# EAGLE schematic board_rev3 (EAGLE 4.16)
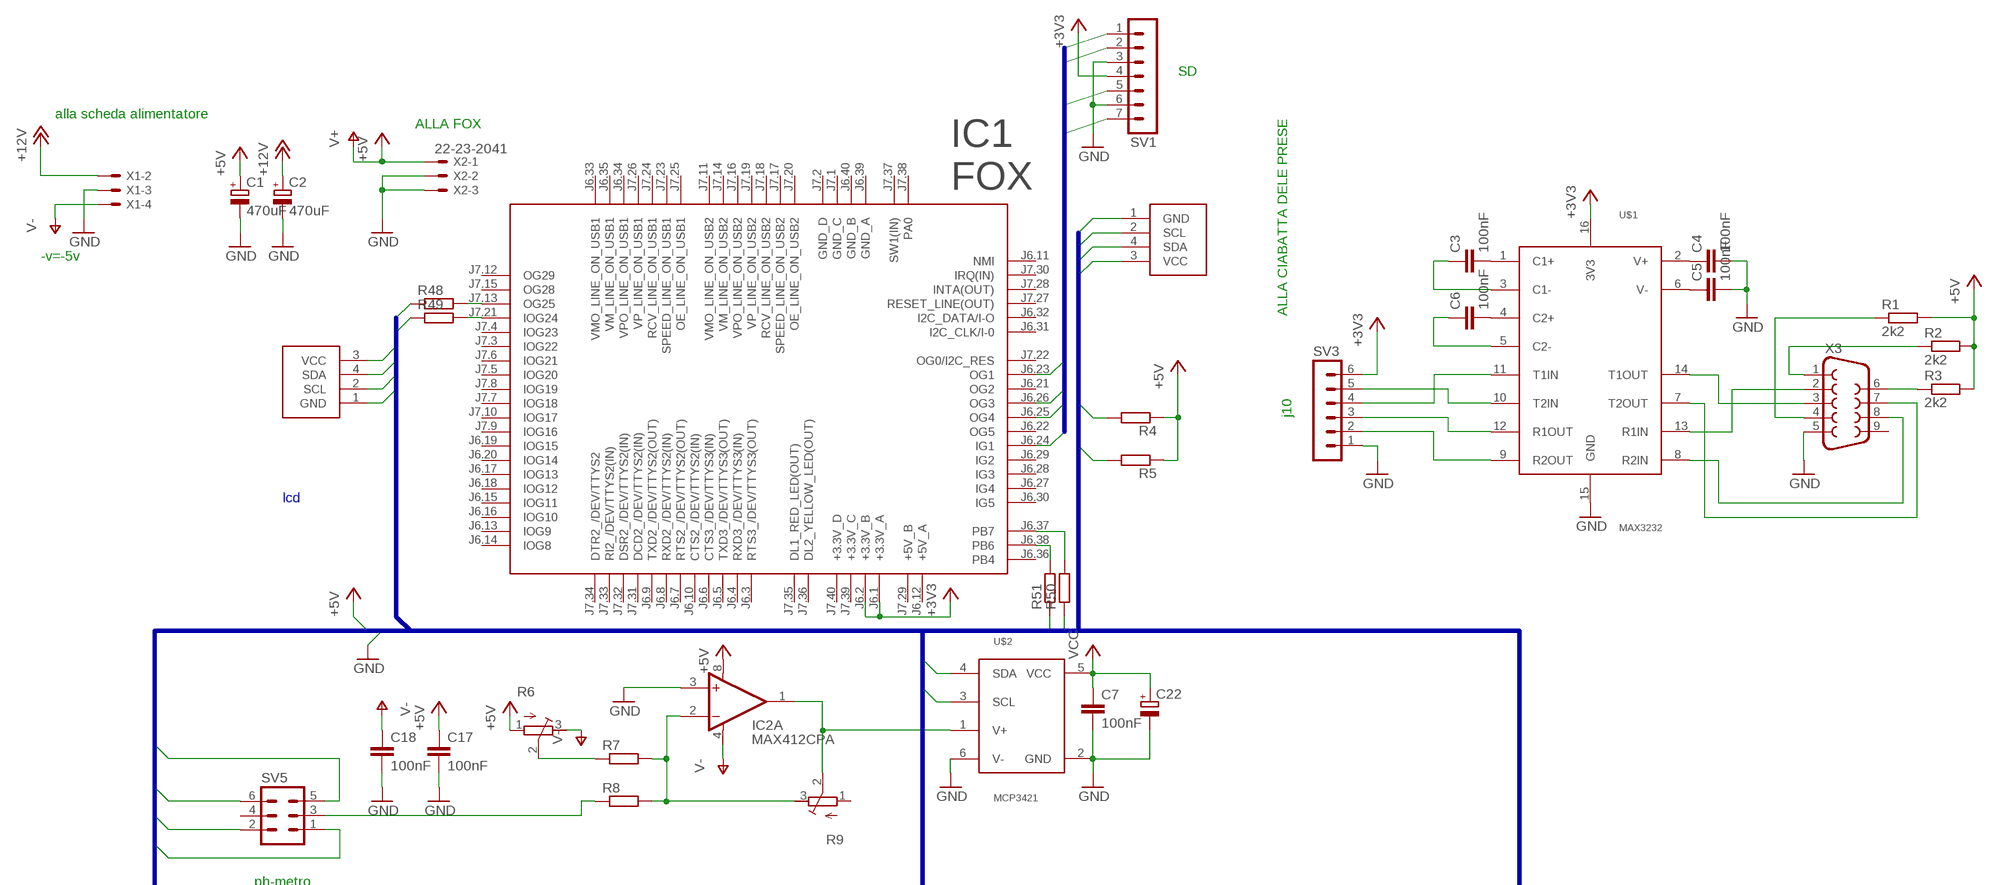
[diagram p0: schematic, sheet 1, part 1 of 2]
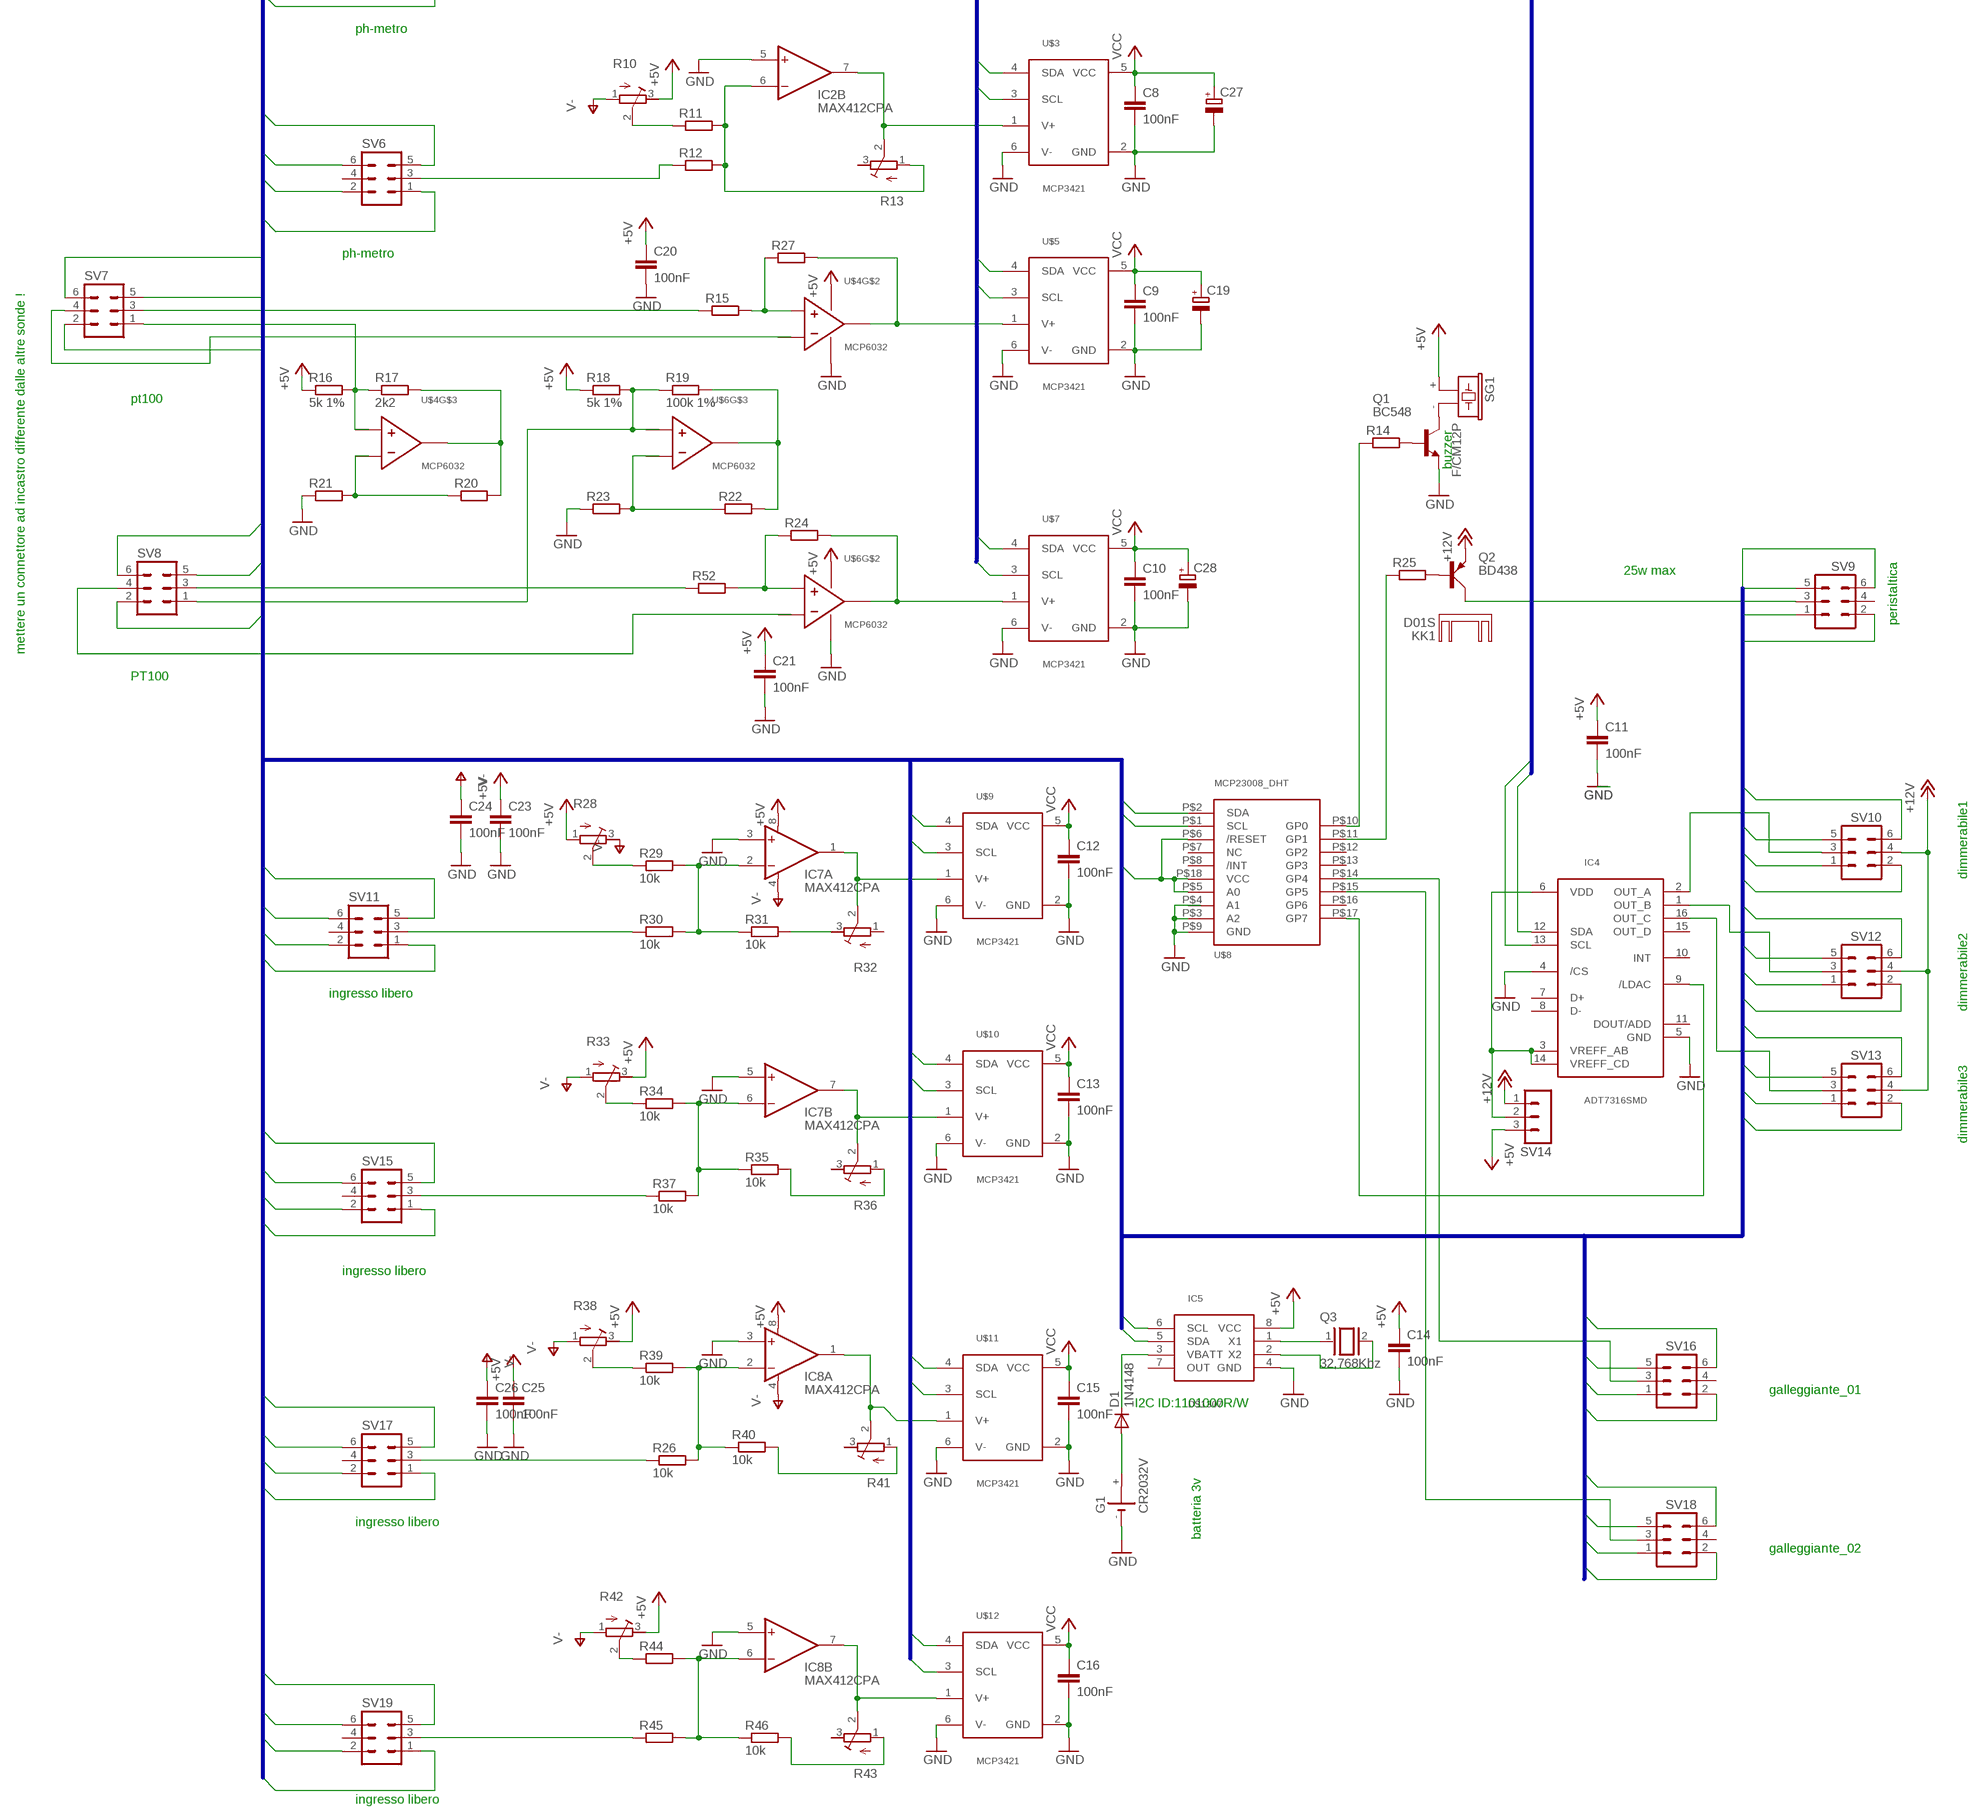
[diagram p1: schematic, sheet 1, part 2 of 2]

## Parts
C1  470uF  CPOL-EUE5-10.5  [E5-10,5]
C2  470uF  CPOL-EUE5-10.5  [E5-10,5]
C3  100nF  C-EUC0402  [C0402]
C4  100nF  C-EUC0402  [C0402]
C5  100nF  C-EUC0402  [C0402]
C6  100nF  C-EUC0402  [C0402]
C7  100nF  C-EUC0402  [C0402]
C8  100nF  C-EUC0402  [C0402]
C9  100nF  C-EUC0402  [C0402]
C10  100nF  C-EUC0402  [C0402]
C11  100nF  C-EUC0402  [C0402]
C12  100nF  C-EUC0402  [C0402]
C13  100nF  C-EUC0402  [C0402]
C14  100nF  C-EUC0402  [C0402]
C15  100nF  C-EUC0402  [C0402]
C16  100nF  C-EUC0402  [C0402]
C17  100nF  C-EUC0402  [C0402]
C18  100nF  C-EUC0402  [C0402]
C19  CPOL-EUB/3528-21W  [B/3528-21W]
C20  100nF  C-EUC0402  [C0402]
C21  100nF  C-EUC0402  [C0402]
C22  CPOL-EUB/3528-21W  [B/3528-21W]
C23  100nF  C-EUC0402  [C0402]
C24  100nF  C-EUC0402  [C0402]
C25  100nF  C-EUC0402  [C0402]
C26  100nF  C-EUC0402  [C0402]
C27  CPOL-EUB/3528-21W  [B/3528-21W]
C28  CPOL-EUB/3528-21W  [B/3528-21W]
D1  1N4148  [DO35-10]
G1  CR2032V  [CR2032V]
IC1  FOX  [FOX]
IC2  MAX412CPA  [DIL08]
IC4  ADT7316SMD  [ADT7318SMD]
IC5  DS1307  [DS1307]
IC7  MAX412CPA  [DIL08]
IC8  MAX412CPA  [DIL08]
KK1  D01S  [D01S]
Q1  BC548  [TO92-EBC]
Q2  BD438  [TO126AV]
Q3  32,768Khz  XTAL  [Q]
R1  2k2  R-EU_0207/10  [0207/10]
R2  2k2  R-EU_0207/10  [0207/10]
R3  2k2  R-EU_0207/10  [0207/10]
R4  R-EU_R0805  [R0805]
R5  R-EU_R0805  [R0805]
R6  R-TRIMM4G/J  [RTRIM4G/J]
R7  R-EU_0309/V  [0309V]
R8  R-EU_0207/10  [0207/10]
R9  R-TRIMM4G/J  [RTRIM4G/J]
R10  R-TRIMM4G/J  [RTRIM4G/J]
R11  R-EU_0309/V  [0309V]
R12  R-EU_0207/10  [0207/10]
R13  R-TRIMM4G/J  [RTRIM4G/J]
R14  R-EU_0309/V  [0309V]
R15  R-EU_0207/5V  [0207/5V]
R16  5k 1%  R-EU_0207/10  [0207/10]
R17  2k2  R-EU_0207/10  [0207/10]
R18  5k 1%  R-EU_0207/10  [0207/10]
R19  100k 1%  R-EU_0207/10  [0207/10]
R20  R-EU_0207/5V  [0207/5V]
R21  R-EU_0207/5V  [0207/5V]
R22  R-EU_0207/5V  [0207/5V]
R23  R-EU_0207/5V  [0207/5V]
R24  R-EU_0207/5V  [0207/5V]
R25  R-EU_0207/5V  [0207/5V]
R26  10k  R-EU_0411/3V  [0411V]
R27  R-EU_0309/V  [0309V]
R28  R-TRIMM4G/J  [RTRIM4G/J]
R29  10k  R-EU_0207/10  [0207/10]
R30  10k  R-EU_0207/10  [0207/10]
R31  10k  R-EU_0411/3V  [0411V]
R32  R-TRIMM4G/J  [RTRIM4G/J]
R33  R-TRIMM4G/J  [RTRIM4G/J]
R34  10k  R-EU_0207/10  [0207/10]
R35  10k  R-EU_0411/3V  [0411V]
R36  R-TRIMM4G/J  [RTRIM4G/J]
R37  10k  R-EU_0207/10  [0207/10]
R38  R-TRIMM4G/J  [RTRIM4G/J]
R39  10k  R-EU_0411/3V  [0411V]
R40  10k  R-EU_0411/3V  [0411V]
R41  R-TRIMM4G/J  [RTRIM4G/J]
R42  R-TRIMM4G/J  [RTRIM4G/J]
R43  R-TRIMM4G/J  [RTRIM4G/J]
R44  R-EU_0309/V  [0309V]
R45  R-EU_0309/V  [0309V]
R46  10k  R-EU_0411/3V  [0411V]
R48  R-EU_R0805  [R0805]
R49  R-EU_R0805  [R0805]
R50  R-EU_R0805  [R0805]
R51  R-EU_R0805  [R0805]
R52  R-EU_0309/V  [0309V]
SG1  F/CM12P  [F/CM12P]
SV1  MA07-1  [MA07-1]
SV3  MA06-1  [MA06-1]
SV5  MA03-2  [MA03-2]
SV6  MA03-2  [MA03-2]
SV7  MA03-2  [MA03-2]
SV8  MA03-2  [MA03-2]
SV9  MA03-2  [MA03-2]
SV10  MA03-2  [MA03-2]
SV11  MA03-2  [MA03-2]
SV12  MA03-2  [MA03-2]
SV13  MA03-2  [MA03-2]
SV14  MA03-1  [MA03-1]
SV15  MA03-2  [MA03-2]
SV16  MA03-2  [MA03-2]
SV17  MA03-2  [MA03-2]
SV18  MA03-2  [MA03-2]
SV19  MA03-2  [MA03-2]
U$1  MAX3232  [MAX3232]
U$2  MCP3421  [MCP3421]
U$3  MCP3421  [MCP3421]
U$4  MAX6032  [MAX6032]
U$5  MCP3421  [MCP3421]
U$6  MAX6032  [MAX6032]
U$7  MCP3421  [MCP3421]
U$8  MCP23008_DHT  [MCP23008_DHT]
U$9  MCP3421  [MCP3421]
U$10  MCP3421  [MCP3421]
U$11  MCP3421  [MCP3421]
U$12  MCP3421  [MCP3421]
U$13  J-I2C  [J-I2C]
U$14  J-I2C  [J-I2C]
X1  22-23-2041  [22-23-2041]
X2  22-23-2041  [22-23-2041]
X3  F09H  [F09H]

## Nets
5V: SV5.5 SV6.5 SV7.4 SV7.5 SV8.5 SV9.5 SV10.5 SV11.5 SV12.5 SV13.5 SV15.5 SV16.5 SV17.5 SV18.5 SV19.5 U$8.P$5(A0) U$8.P$6(/RESET) U$8.P$18(VCC) U$13.3(VCC) U$14.3(VCC) ; supply symbol labelled +5V
+3V3: IC1.J6.1(+3.3V_A) IC1.J6.2(+3.3V_B) SV1.4 SV3.6 U$1.16(3V3)
+5V: C1.+ C11.1 C14.1 C17.1 C20.1 C21.1 C23.1 C25.1 IC5.8(VCC) IC7.8(A:V+) IC8.8(A:V+) R1.2 R2.2 R3.2 R4.1 R5.1 R6.1(E) R10.3(A) R16.1 R18.1 R28.1(E) R33.3(A) R38.3(A) R42.3(A) SG1.+ SV14.3 U$4.P$8(VCC) U$6.P$8(VCC) X2.1 ; supply symbol labelled V+
+12V: C2.+ Q2.E SV10.4 SV12.4 SV13.4 SV14.1 X1.2
CH0: IC8.7(B:OUT) R43.2(S) U$12.1(V+)
CH1: IC8.1(A:OUT) R41.2(S) U$11.1(V+)
CH2: IC7.7(B:OUT) R36.2(S) U$10.1(V+)
CH3: IC7.1(A:OUT) R32.2(S) U$9.1(V+)
GND: C1.- C2.- C4.2 C5.2 C7.2 C8.2 C9.2 C10.2 C11.2 C12.2 C13.2 C14.2 C15.2 C16.2 C17.2 C18.2 C19.- C20.2 C21.2 C22.- C23.2 C24.2 C25.2 C26.2 C27.- C28.- G1.- IC2.3(A:+IN) IC2.5(B:+IN) IC4.4(/CS) IC4.5(GND) IC5.4(GND) IC7.3(A:+IN) IC7.5(B:+IN) IC8.3(A:+IN) IC8.5(B:+IN) Q1.E R21.1 R23.1 SV1.3 SV1.6 SV3.1 SV5.1 SV6.1 SV9.1 SV10.1 SV11.1 SV12.1 SV13.1 SV15.1 SV16.1 SV17.1 SV18.1 SV19.1 U$1.15(GND) U$2.2(GND) U$2.6(V-) U$3.2(GND) U$3.6(V-) U$4.P$4(GND) U$5.2(GND) U$5.6(V-) U$6.P$4(GND) U$7.2(GND) U$7.6(V-) U$8.P$3(A2) U$8.P$9(GND) U$9.2(GND) U$9.6(V-) U$10.2(GND) U$10.6(V-) U$11.2(GND) U$11.6(V-) U$12.2(GND) U$12.6(V-) U$13.1(GND) U$14.1(GND) X1.3 X2.2 X2.3 X3.5
N$1: R14.1 U$8.P$10(GP0)
N$2: R17.2 R20.2 U$4.P$7(O)
N$3: R19.2 R22.2 U$6.P$7(O)
N$4: D1.C IC5.3(VBATT)
N$5: R24.1 R52.2
N$6: R15.2 R27.1
N$7: SV8.4
N$8: R20.1 R21.2
N$9: IC2.1(A:OUT) R9.2(S) U$2.1(V+)
N$10: IC2.7(B:OUT) R13.2(S) U$3.1(V+)
N$11: SV18.3 U$8.P$15(GP5)
N$12: D1.A G1.+
N$13: R27.2 U$4.P$1(O) U$5.1(V+)
N$14: Q2.B R25.2
N$15: IC1.J7.13(OG25) R48.2
N$16: R25.1 U$8.P$11(GP1)
N$17: IC4.16(OUT_C) SV13.3
N$18: SV16.3 U$8.P$14(GP4)
N$19: Q2.C SV9.3
N$20: Q1.C SG1.-
N$21: IC4.3(VREFF_AB) IC4.6(VDD) IC4.14(VREFF_CD) SV14.2
N$22: R24.2 U$6.P$1(O) U$7.1(V+)
N$23: IC4.2(OUT_A) SV10.3
N$25: IC4.9(/LDAC) U$8.P$17(GP7)
N$26: Q1.B R14.2
N$27: C3.2 U$1.1(C1+)
N$28: R18.2 R19.1 SV8.1
N$29: R16.2 R17.1 SV7.1
N$30: R35.2 R36.1(E)
N$31: R10.2(S) R11.1
N$33: R40.2 R41.1(E)
N$34: R43.1(E) R46.2
N$35: R31.2 R32.3(A)
N$36: U$1.14(T1OUT) X3.3
N$37: R15.1 SV7.3
N$38: R52.1 SV8.3
N$39: C6.2 U$1.4(C2+)
N$40: U$1.13(R1IN) X3.2
N$41: C5.1 U$1.6(V-)
N$42: C3.1 U$1.3(C1-)
N$43: C4.1 U$1.2(V+)
N$44: C6.1 U$1.5(C2-)
N$45: U$1.8(R2IN) X3.8
N$46: U$1.7(T2OUT) X3.7
N$47: R2.1 X3.1
N$48: R1.1 X3.4
N$49: R3.1 X3.6
N$50: IC4.1(OUT_B) SV12.3
N$53: IC1.J7.21(IOG24) R49.2
N$54: IC1.J6.38(PB6) R51.2
N$55: SV3.4 U$1.11(T1IN)
N$56: SV3.3 U$1.12(R1OUT)
N$57: SV3.5 U$1.10(T2IN)
N$58: IC2.2(A:-IN) R7.2 R8.2 R9.3(A)
N$59: SV3.2 U$1.9(R2OUT)
N$60: R8.1 SV5.3
N$61: IC1.J6.37(PB7) R50.2
N$62: R6.2(S) R7.1
N$63: IC2.6(B:-IN) R11.2 R12.2 R13.1(E)
N$66: R22.1 R23.2
N$69: R12.1 SV6.3
N$83: IC5.1(X1) Q3.1
N$84: IC5.2(X2) Q3.2
N$113: IC7.2(A:-IN) R29.2 R30.2 R31.1
N$114: IC7.6(B:-IN) R34.2 R35.1 R37.2
N$115: IC8.2(A:-IN) R26.2 R39.2 R40.1
N$116: IC8.6(B:-IN) R44.2 R45.2 R46.1
N$117: R45.1 SV19.3
N$119: R26.1 SV17.3
N$121: R42.2(S) R44.1
N$122: R38.2(S) R39.1
N$123: R33.2(S) R34.1
N$124: R37.1 SV15.3
N$125: R30.1 SV11.3
N$126: R28.2(S) R29.1
SCL: IC4.13(SCL) IC5.6(SCL) R5.2 R48.1 R50.1 SV5.2 SV6.2 SV7.2 SV8.2 SV9.2 SV10.2 SV11.2 SV12.2 SV13.2 SV15.2 SV16.2 SV17.2 SV18.2 SV19.2 U$2.3(SCL) U$3.3(SCL) U$5.3(SCL) U$7.3(SCL) U$8.P$1(SCL) U$9.3(SCL) U$10.3(SCL) U$11.3(SCL) U$12.3(SCL) U$13.2(SCL) U$14.2(SCL)
SD1: IC1.J6.26(OG3) SV1.1
SD2: IC1.J6.25(OG4) SV1.2
SD5: IC1.J6.23(OG1) SV1.5
SD7: IC1.J6.24(IG1) SV1.7
SDA: IC4.12(SDA) IC5.5(SDA) R4.2 R49.1 R51.1 SV5.6 SV6.6 SV7.6 SV8.6 SV9.6 SV10.6 SV11.6 SV12.6 SV13.6 SV15.6 SV16.6 SV17.6 SV18.6 SV19.6 U$2.4(SDA) U$3.4(SDA) U$5.4(SDA) U$7.4(SDA) U$8.P$2(SDA) U$9.4(SDA) U$10.4(SDA) U$11.4(SDA) U$12.4(SDA) U$13.4(SDA) U$14.4(SDA)
V-: C18.1 C24.1 C26.1 IC7.4(A:V-) IC8.4(A:V-) R6.3(A) R10.1(E) R28.3(A) R33.1(E) R38.1(E) R42.1(E) X1.4
VCC: C7.1 C8.1 C9.1 C10.1 C12.1 C13.1 C15.1 C16.1 C19.+ C22.+ C27.+ C28.+ U$2.5(VCC) U$3.5(VCC) U$5.5(VCC) U$7.5(VCC) U$9.5(VCC) U$10.5(VCC) U$11.5(VCC) U$12.5(VCC)
Unconnected: G1.+@1(+) IC1.J6.3(RTS3_/DEV/TTYS3(OUT)) IC1.J6.4(RXD3_/DEV/TTYS3(IN)) IC1.J6.5(TXD3_/DEV/TTYS3(OUT)) IC1.J6.6(CTS3_/DEV/TTYS3(IN)) IC1.J6.7(RTS2_/DEV/TTYS2(OUT)) IC1.J6.8(RXD2_/DEV/TTYS2(IN)) IC1.J6.9(TXD2_/DEV/TTYS2(OUT)) IC1.J6.10(CTS2_/DEV/TTYS2(IN)) IC1.J6.11(NMI) IC1.J6.12(+5V_A) IC1.J6.13(IOG9) IC1.J6.14(IOG8) IC1.J6.15(IOG11) IC1.J6.16(IOG10) IC1.J6.17(IOG13) IC1.J6.18(IOG12) IC1.J6.19(IOG15) IC1.J6.20(IOG14) IC1.J6.21(OG2) IC1.J6.22(OG5) IC1.J6.27(IG4) IC1.J6.28(IG3) IC1.J6.29(IG2) IC1.J6.30(IG5) IC1.J6.31(I2C_CLK/I-0) IC1.J6.32(I2C_DATA/I-O) IC1.J6.33(VMO_LINE_ON_USB1) IC1.J6.34(VPO_LINE_ON_USB1) IC1.J6.35(VM_LINE_ON_USB1) IC1.J6.36(PB4) IC1.J6.39(GND_A) IC1.J6.40(GND_B) IC1.J7.1(GND_C) IC1.J7.2(GND_D) IC1.J7.3(IOG22) IC1.J7.4(IOG23) IC1.J7.5(IOG20) IC1.J7.6(IOG21) IC1.J7.7(IOG18) IC1.J7.8(IOG19) IC1.J7.9(IOG16) IC1.J7.10(IOG17) IC1.J7.11(VMO_LINE_ON_USB2) IC1.J7.12(OG29) IC1.J7.14(VM_LINE_ON_USB2) IC1.J7.15(OG28) IC1.J7.16(VPO_LINE_ON_USB2) IC1.J7.17(SPEED_LINE_ON_USB2) IC1.J7.18(RCV_LINE_ON_USB2) IC1.J7.19(VP_LINE_ON_USB2) IC1.J7.20(OE_LINE_ON_USB2) IC1.J7.22(OG0/I2C_RES) IC1.J7.23(SPEED_LINE_ON_USB1) IC1.J7.24(RCV_LINE_ON_USB1) IC1.J7.25(OE_LINE_ON_USB1) IC1.J7.26(VP_LINE_ON_USB1) IC1.J7.27(RESET_LINE(OUT)) IC1.J7.28(INTA(OUT)) IC1.J7.29(+5V_B) IC1.J7.30(IRQ(IN)) IC1.J7.31(DCD2_/DEV/TTYS2(IN)) IC1.J7.32(DSR2_/DEV/TTYS2(IN)) IC1.J7.33(RI2_/DEV/TTYS2(IN)) IC1.J7.34(DTR2_/DEV/TTYS2) IC1.J7.35(DL1_RED_LED(OUT)) IC1.J7.36(DL2_YELLOW_LED(OUT)) IC1.J7.37(SW1(IN)) IC1.J7.38(PA0) IC1.J7.39(+3.3V_C) IC1.J7.40(+3.3V_D) IC4.7(D+) IC4.8(D-) IC4.10(INT) IC4.11(DOUT/ADD) IC4.15(OUT_D) IC5.7(OUT) R9.1(E) R13.3(A) R32.1(E) R36.3(A) R41.3(A) R43.3(A) SV5.4 SV6.4 SV9.4 SV11.4 SV15.4 SV16.4 SV17.4 SV18.4 SV19.4 U$4.P$2(-) U$4.P$3(+) U$4.P$5(+) U$4.P$6(-) U$6.P$2(-) U$6.P$3(+) U$6.P$5(+) U$6.P$6(-) U$8.P$4(A1) U$8.P$7(NC) U$8.P$8(/INT) U$8.P$12(GP2) U$8.P$13(GP3) U$8.P$16(GP6) X1.1 X2.4 X3.9

## Buses
BUS:SDA,SCL,GND,5V
SD[1..7]

## Notes on the sheet
- SD
- alla scheda alimentatore | ALLA FOX | ALLA CIABATTA DELE PRESE
- -v=-5v
- j10
- lcd
- ph-metro
- ph-metro
- pt100
- buzzer
- peristaltica
- 25w max
- mettere un connettore ad incastro differente dalle altre sonde !
- PT100
- dimmerabile1
- ingresso libero
- dimmerabile2
- dimmerabile3
- ingresso libero
- galleggiante_01
- I2C ID:1101000R/W
- ingresso libero
- batteria 3v
- galleggiante_02
- ingresso libero

## Power pins joined to a net without a drawn wire
V+: IC2.8(A:V+)
V-: IC2.4(A:V-)

## Library data of the parts
C1 C2 C19 C22 C27 C28 = rcl:CPOL-EU: POLARIZED CAPACITOR, European symbol
C3-C18 C20 C21 C23-C26 = rcl:C-EU: CAPACITOR, European symbol
D1 = diode:1N4148: DIODE high speed (Philips)
G1 = battery:CR2032V: LI BATTERY Varta
IC1 = aggiunte:FOX: FOXBOARD Un sistema linux embedded completo www.acmesystem.it
IC2 IC7 IC8 = maxim:MAX412CPA: OP AMP
IC4 = aggiunte:ADT7316SMD: ADT7318 smd I2C DAC 4 Ch
IC5 = aggiunte:DS1307: DS1307 calendario e orologio I2C
KK1 = heatsink:D01S: HEATSINK distributor Schukat
Q1 = transistor-npn:BC548*: NPN Transistor
Q2 = transistor-power:BD438: PNP TRANSISTOR
Q3 = special:XTAL: CRYSTAL
R1-R5 R7 R8 R11 R12 R14-R27 R29-R31 R34 R35 R37 R39 R40 R44-R46 R48-R52 = rcl:R-EU_: RESISTOR, European symbol
R6 R9 R10 R13 R28 R32 R33 R36 R38 R41-R43 = rcl:R-TRIMM: Trimm resistor
SG1 = buzzer:F/CM12P: BUZZER Source: Buerklin
SV1 = con-lstb:MA07-1: PIN HEADER
SV3 = con-lstb:MA06-1: PIN HEADER
SV5-SV13 SV15-SV19 = con-lstb:MA03-2: PIN HEADER
SV14 = con-lstb:MA03-1: PIN HEADER
U$1 = aggiunte:MAX3232: MAX3232 3.3v rs232 transceiver @ 5v supply
U$2 U$3 U$5 U$7 U$9-U$12 = aggiunte:MCP3421: MCP3421 differential analog to i2c @ 12/14/18bit
U$4 U$6 = aggiunte:MAX6032: MCP6032 calendario e orologio I2C
U$8 = aggiunte:MCP23008_DHT: MCP23008 I2C EXPANDER 8 Ch
U$13 U$14 = aggiunte:J-I2C: connettore 4polare telefonico usatro x i2c
X1 X2 = con-molex:22-23-2041: .100" (2.54mm) Center Header - 4 Pin
X3 = con-subd:F09: SUB-D

## Net classes
0 default: width 0.61 mm